# EAGLE design Output Mixer v1.1 (EAGLE 7.7.0)
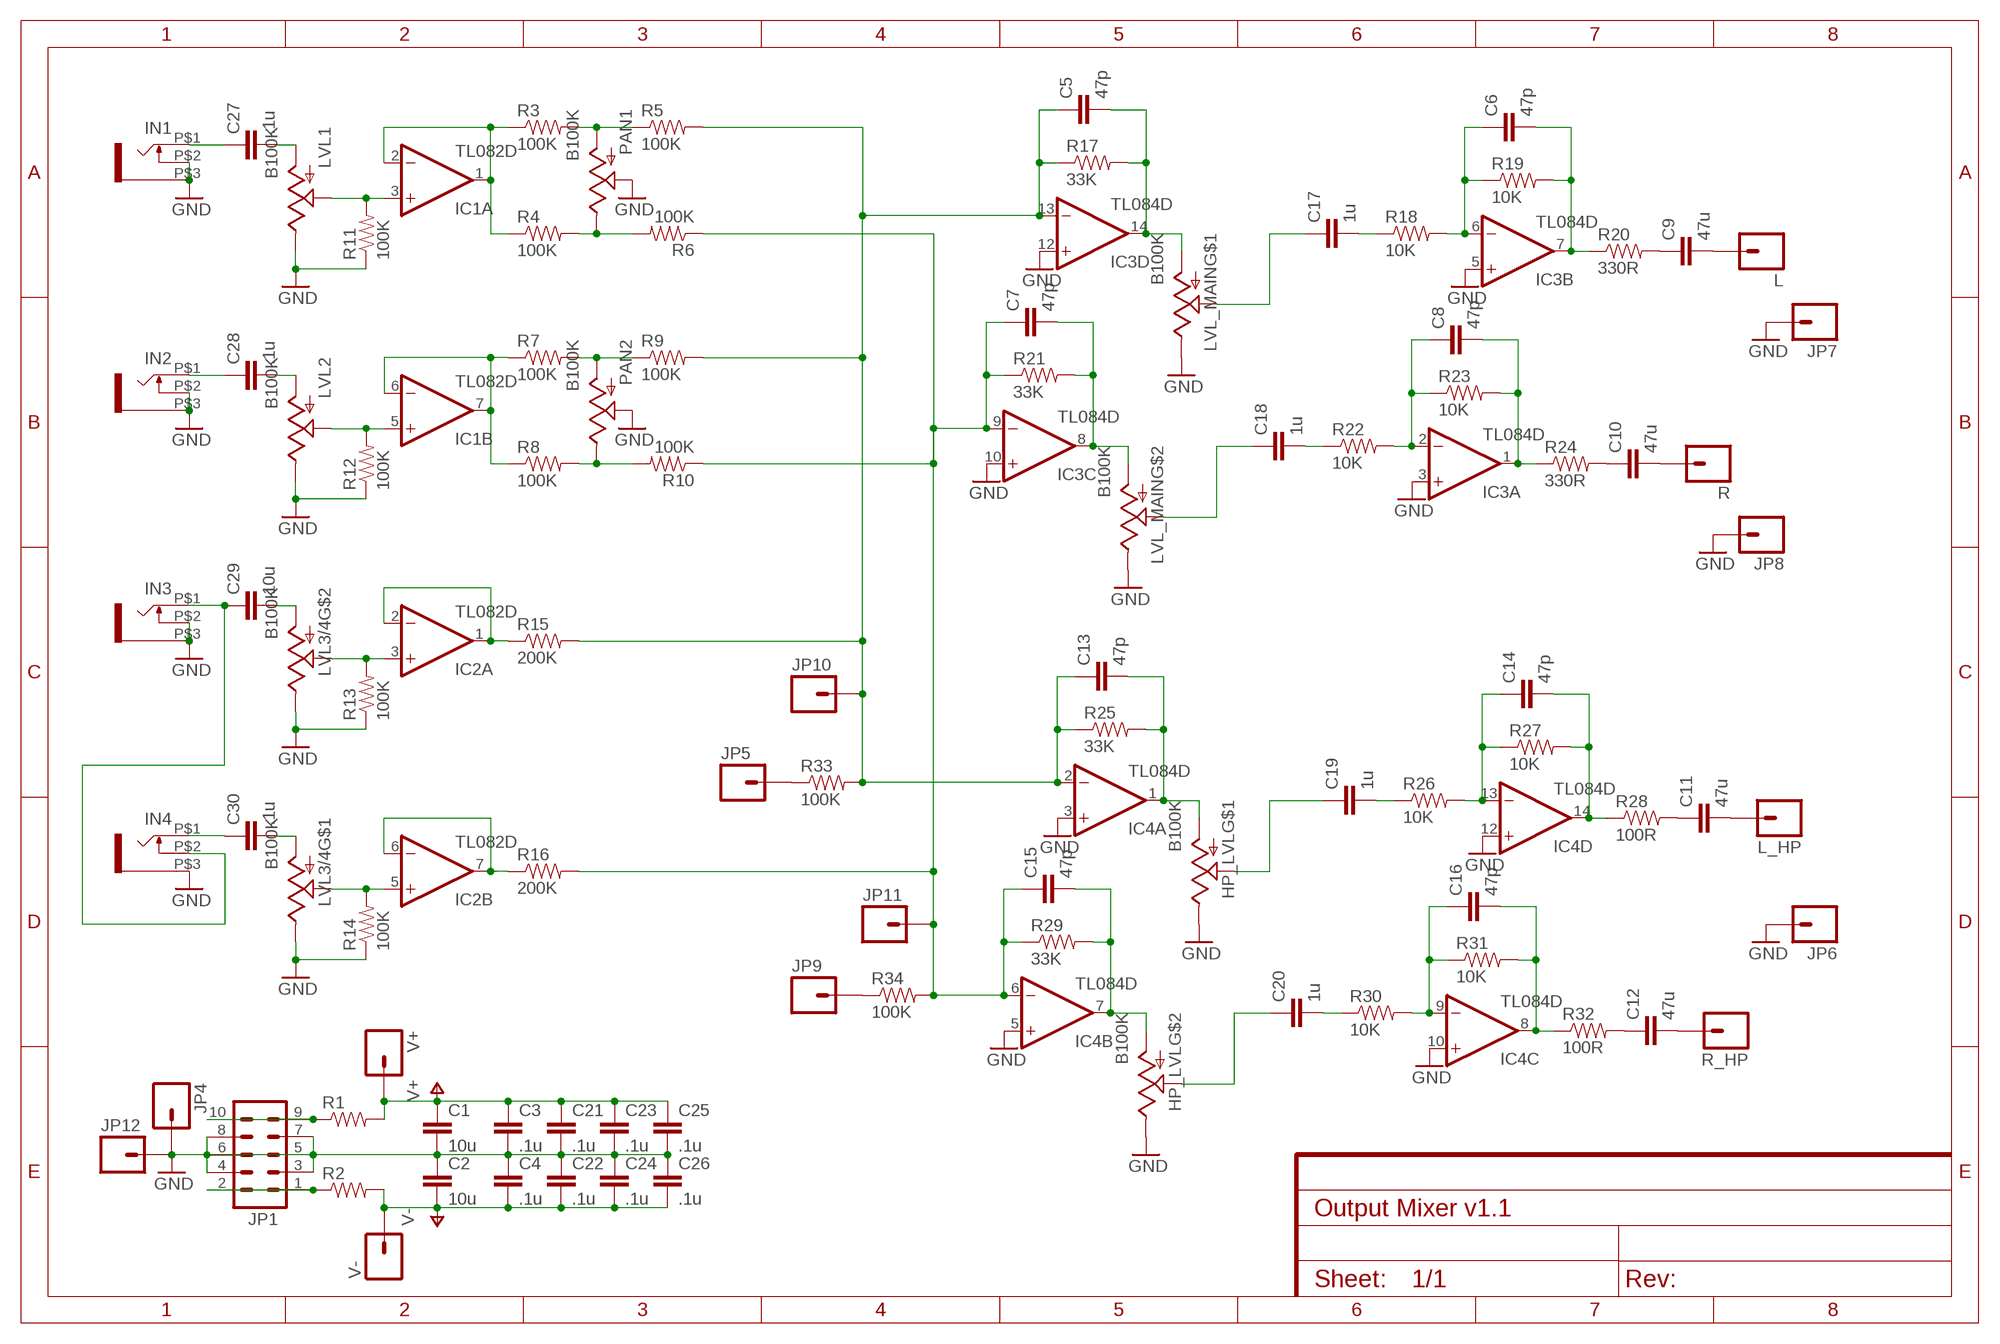
[diagram p0: schematic, sheet 1]

## Parts
C1  10u  CAP1206  [1206]
C2  10u  CAP1206  [1206]
C3  .1u  CAP0805  [0805]
C4  .1u  CAP0805  [0805]
C5  47p  CAP0805  [0805]
C6  47p  CAP0805  [0805]
C7  47p  CAP0805  [0805]
C8  47p  CAP0805  [0805]
C9  47u  CAP1206  [1206]
C10  47u  CAP1206  [1206]
C11  47u  CAP1206  [1206]
C12  47u  CAP1206  [1206]
C13  47p  CAP0805  [0805]
C14  47p  CAP0805  [0805]
C15  47p  CAP0805  [0805]
C16  47p  CAP0805  [0805]
C17  1u  CAP0805  [0805]
C18  1u  CAP0805  [0805]
C19  1u  CAP0805  [0805]
C20  1u  CAP0805  [0805]
C21  .1u  CAP0805  [0805]
C22  .1u  CAP0805  [0805]
C23  .1u  CAP0805  [0805]
C24  .1u  CAP0805  [0805]
C25  .1u  CAP0805  [0805]
C26  .1u  CAP0805  [0805]
C27  .1u  CAP1206  [1206]
C28  .1u  CAP1206  [1206]
C29  10u  CAP1206  [1206]
C30  .1u  CAP1206  [1206]
HP_LVL  B100K  POT_DUAL_ALPHA  [ALPS/ALPHA_POT_DUAL]
IC1  TL082D  [SO08]
IC2  TL082D  [SO08]
IC3  TL084D  [SO14]
IC4  TL084D  [SO14]
IN1  WQP-PJ301M-12_JACK  [WQP-PJ301M-12_JACK]
IN2  WQP-PJ301M-12_JACK  [WQP-PJ301M-12_JACK]
IN3  WQP-PJ301M-12_JACK  [WQP-PJ301M-12_JACK]
IN4  WQP-PJ301M-12_JACK  [WQP-PJ301M-12_JACK]
JP1  M05X2PTH  [AVR_ICSP]
JP4  M01PTH  [1X01]
JP5  M01PTH  [1X01]
JP6  M01PTH  [1X01]
JP7  M01PTH  [1X01]
JP8  M01PTH  [1X01]
JP9  M01PTH  [1X01]
JP10  M01PTH  [1X01]
JP11  M01PTH  [1X01]
JP12  M01PTH  [1X01]
L  M01PTH  [1X01]
L_HP  M01PTH  [1X01]
LVL1  B100K  POT  [ALPS_POT]
LVL2  B100K  POT  [ALPS_POT]
LVL3/4  B100K  POT_DUAL_ALPHA  [ALPS/ALPHA_POT_DUAL]
LVL_MAIN  B100K  POT_DUAL_ALPHA  [ALPS/ALPHA_POT_DUAL]
PAN1  B100K  POT  [ALPS_POT]
PAN2  B100K  POT  [ALPS_POT]
R  M01PTH  [1X01]
R1  RESISTOR0805-RES  [0805]
R2  RESISTOR0805-RES  [0805]
R3  100K  RESISTOR0805-RES  [0805]
R4  100K  RESISTOR0805-RES  [0805]
R5  100K  RESISTOR0805-RES  [0805]
R6  100K  RESISTOR0805-RES  [0805]
R7  100K  RESISTOR0805-RES  [0805]
R8  100K  RESISTOR0805-RES  [0805]
R9  100K  RESISTOR0805-RES  [0805]
R10  100K  RESISTOR0805-RES  [0805]
R11  100K  RESISTOR0805-RES  [0805]
R12  100K  RESISTOR0805-RES  [0805]
R13  100K  RESISTOR0805-RES  [0805]
R14  100K  RESISTOR0805-RES  [0805]
R15  200K  RESISTOR0805-RES  [0805]
R16  200K  RESISTOR0805-RES  [0805]
R17  33K  RESISTOR0805-RES  [0805]
R18  10K  RESISTOR0805-RES  [0805]
R19  10K  RESISTOR0805-RES  [0805]
R20  330R  RESISTOR0805-RES  [0805]
R21  33K  RESISTOR0805-RES  [0805]
R22  10K  RESISTOR0805-RES  [0805]
R23  10K  RESISTOR0805-RES  [0805]
R24  330R  RESISTOR0805-RES  [0805]
R25  33K  RESISTOR0805-RES  [0805]
R26  10K  RESISTOR0805-RES  [0805]
R27  10K  RESISTOR0805-RES  [0805]
R28  100R  RESISTOR0805-RES  [0805]
R29  33K  RESISTOR0805-RES  [0805]
R30  10K  RESISTOR0805-RES  [0805]
R31  10K  RESISTOR0805-RES  [0805]
R32  100R  RESISTOR0805-RES  [0805]
R33  100K  RESISTOR0805-RES  [0805]
R34  100K  RESISTOR0805-RES  [0805]
R_HP  M01PTH  [1X01]
V+  M01PTH  [1X01]
V-  M01PTH  [1X01]

## Nets
GND: C1.2 C2.1 C3.2 C4.1 C21.2 C22.1 C23.2 C24.1 C25.2 C26.1 HP_LVL.P$1(E) HP_LVL.P$4(E) IC3.3(A:+IN) IC3.5(B:+IN) IC3.10(C:+IN) IC3.12(D:+IN) IC4.3(A:+IN) IC4.5(B:+IN) IC4.10(C:+IN) IC4.12(D:+IN) IN1.P$2 IN1.P$3 IN2.P$2 IN2.P$3 IN3.P$2 IN3.P$3 IN4.P$3 JP1.3 JP1.4 JP1.5 JP1.6 JP1.7 JP1.8 JP4.1 JP6.1 JP7.1 JP8.1 JP12.1 LVL1.P$1(E) LVL2.P$1(E) LVL3/4.P$1(E) LVL3/4.P$4(E) LVL_MAIN.P$1(E) LVL_MAIN.P$4(E) PAN1.P$2(S) PAN2.P$2(S) R11.1 R12.1 R13.1 R14.1
N$1: JP1.9 JP1.10 R1.1
N$2: JP1.1 JP1.2 R2.1
N$3: JP5.1 R33.1
N$4: JP9.1 R34.1
N$5: C30.1 IN4.P$1
N$6: C30.2 LVL3/4.P$3(A)
N$7: IC1.3(A:+IN) LVL1.P$2(S) R11.2
N$8: IC1.5(B:+IN) LVL2.P$2(S) R12.2
N$9: IC2.6(B:-IN) IC2.7(B:OUT) R16.1
N$10: IC1.1(A:OUT) IC1.2(A:-IN) R3.1 R4.1
N$11: IC1.6(B:-IN) IC1.7(B:OUT) R7.1 R8.1
N$12: PAN1.P$3(A) R3.2 R5.1
N$13: PAN1.P$1(E) R4.2 R6.2
N$14: PAN2.P$3(A) R7.2 R9.1
N$15: PAN2.P$1(E) R8.2 R10.2
N$16: C29.1 IN3.P$1 IN4.P$2
N$17: IC2.3(A:+IN) LVL3/4.P$5(S) R13.2
N$18: C9.1 R20.2
N$19: IC2.5(B:+IN) LVL3/4.P$2(S) R14.2
N$20: IC2.1(A:OUT) IC2.2(A:-IN) R15.1
N$21: C10.1 R24.2
N$22: C7.2 IC3.8(C:OUT) LVL_MAIN.P$6(A) R21.2
N$23: C8.1 IC3.2(A:-IN) R22.2 R23.1
N$24: C8.2 IC3.1(A:OUT) R23.2 R24.1
N$25: C11.1 R28.2
N$26: C5.2 IC3.14(D:OUT) LVL_MAIN.P$3(A) R17.2
N$27: C6.1 IC3.6(B:-IN) R18.2 R19.1
N$28: C6.2 IC3.7(B:OUT) R19.2 R20.1
N$29: C12.1 R32.2
N$30: C12.2 R_HP.1
N$31: C11.2 L_HP.1
N$32: C9.2 L.1
N$33: C19.1 HP_LVL.P$2(S)
N$34: C19.2 R26.1
N$35: C7.1 C15.1 IC3.9(C:-IN) IC4.6(B:-IN) JP11.1 R6.1 R10.1 R16.2 R21.1 R29.1 R34.2
N$36: C15.2 HP_LVL.P$6(A) IC4.7(B:OUT) R29.2
N$37: C16.1 IC4.9(C:-IN) R30.2 R31.1
N$38: C16.2 IC4.8(C:OUT) R31.2 R32.1
N$39: C5.1 C13.1 IC3.13(D:-IN) IC4.2(A:-IN) JP10.1 R5.2 R9.2 R15.2 R17.1 R25.1 R33.2
N$40: C13.2 HP_LVL.P$3(A) IC4.1(A:OUT) R25.2
N$41: C14.1 IC4.13(D:-IN) R26.2 R27.1
N$42: C14.2 IC4.14(D:OUT) R27.2 R28.1
N$43: C10.2 R.1
N$44: C20.1 HP_LVL.P$5(S)
N$45: C20.2 R30.1
N$46: C29.2 LVL3/4.P$6(A)
N$47: C18.1 LVL_MAIN.P$5(S)
N$48: C28.1 IN2.P$1
N$49: C28.2 LVL2.P$3(A)
N$50: C27.1 IN1.P$1
N$51: C27.2 LVL1.P$3(A)
N$52: C18.2 R22.1
N$53: C17.1 LVL_MAIN.P$2(S)
N$54: C17.2 R18.1
V+: C1.1 C3.1 C21.1 C23.1 C25.1 R1.2 V+.1
V-: C2.2 C4.2 C22.2 C24.2 C26.2 R2.2 V-.1

## Power pins joined to a net without a drawn wire
V+: IC1.8(P:V+) IC2.8(P:V+) IC3.4(P:V+) IC4.4(P:V+)
V-: IC1.4(P:V-) IC2.4(P:V-) IC3.11(P:V-) IC4.11(P:V-)

## Library data of the parts
C1-C30 = SparkFun-Capacitors:CAP: Capacitor Standard 0603 ceramic capacitor, and 0.1" leaded capacitor.
HP_LVL LVL3/4 LVL_MAIN = SparkFun-Electromechanical:POT_DUAL_ALPHA
IC1 IC2 = linear:TL082: OP AMP Data sheet <http://www.ti.com/lit/ds/symlink/tl084a . pdf>; DATA_SHEET: <a href="http://www.ti.com/lit/ds/symlink/tl084a.pdf"> Data sheet </a>
IC3 IC4 = linear:TL084: OP AMP
IN1-IN4 = thonkiconn:WQP-PJ301M-12_JACK
JP1 = SparkFun-Connectors:M05X2: Header 5x2 Standard 10-pin dual row 0.1" header. Commonly used with AVR-ISP. Use with Spark Fun Electronics SKU: PRT-00778
JP4-JP12 L L_HP R R_HP V+ V- = SparkFun-Connectors:M01: Header 1 Standard 1-pin 0.1" header. Use with straight break away headers (SKU : PRT-00116), right angle break away headers (PRT-00553), swiss pins (PRT-00743), machine pins (PRT-00117), and female headers (PRT-00115).
LVL1 LVL2 PAN1 PAN2 = SparkFun-Electromechanical:POT; PROD_ID: RES-09177
R1-R34 = SparkFun-Passives:RESISTOR: Resistor Basic schematic elements and footprints for 0603, 1206, and PTH resistors.

## Board
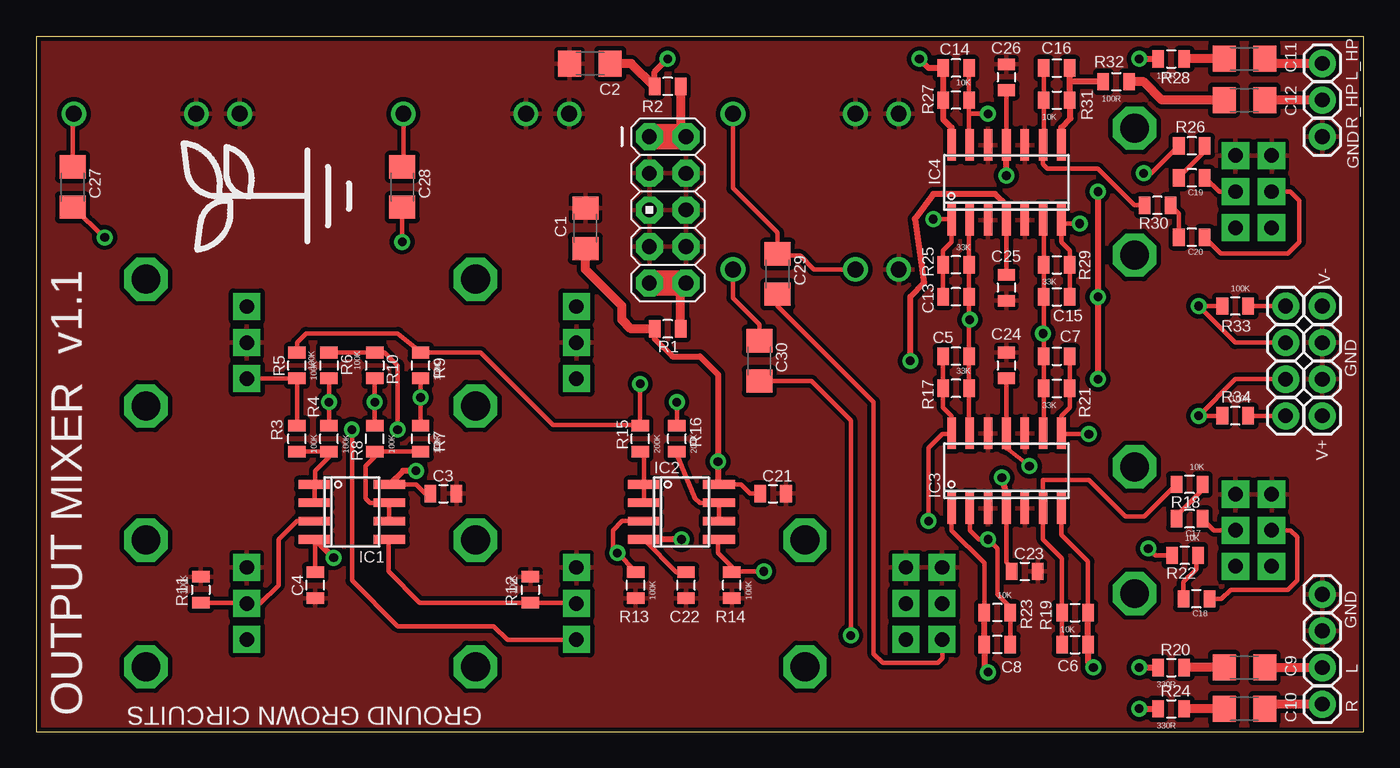
[diagram p1: board, top side]
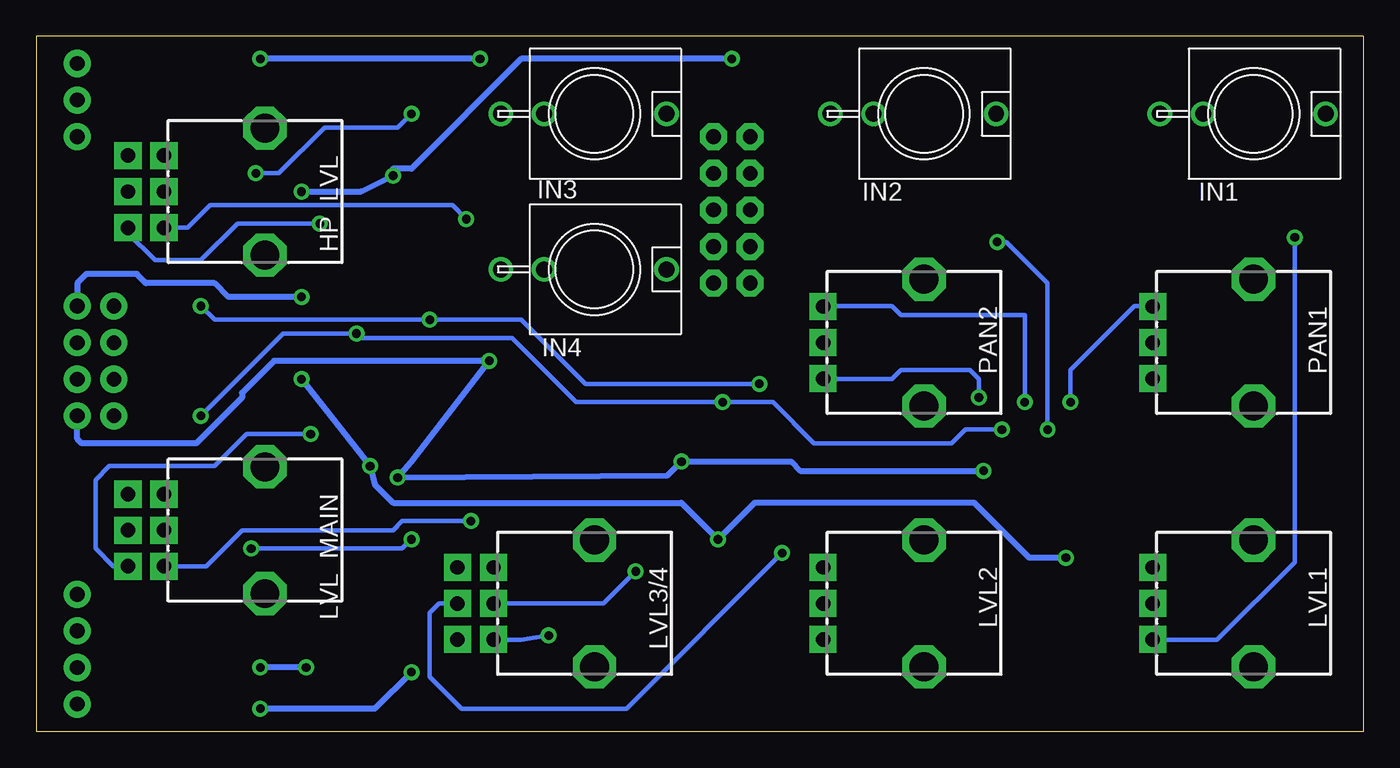
[diagram p2: board, bottom side, seen from below]

Size 92.08 x 48.26 mm. Coordinates in mm from the lower left corner, seen from the top.
Outline: 0,0 92.08,0 92.08,48.26 0,48.26 0,0
Copper layers (1*16): Top 0.035mm / dielectric 1.5mm / Bottom 0.035mm
Design rules "SparkFun": minimum track width 8mil, minimum drill 20mil, track to track 8mil, track to pad 8mil, pad to pad 8mil, via to via 8mil, smd to smd 8mil, copper to edge 8mil, drill to drill 8mil, minimum pad ring 12mil, minimum via ring 10mil, stop-mask expansion 4mil, vias tented up to drill 20mil, thermal gap 10mil

### Footprints (pad centres in the part's own frame; a part is rotated, then mirrored left to right if it is on the bottom)
1206 = smd 1.6 x 1.8: 1 -1.4,0; 2 1.4,0
0805 = smd 0.8 x 1.2: 1 -0.9,0; 2 0.9,0
ALPS/ALPHA_POT_DUAL = drill 1 pad 1.88 square: P$1 7,-2.5; P$2 7,0; P$3 7,2.5; P$4 9.5,-2.5; P$5 9.5,0; P$6 9.5,2.5 | drill 2 octagon: P$A 0,-4.4; P$B 0,4.4
SO08 = smd 0.6 x 2.2: 1 -1.905,-2.6; 2 -0.635,-2.6; 3 0.635,-2.6; 4 1.905,-2.6; 5 1.905,2.6; 6 0.635,2.6; 7 -0.635,2.6; 8 -1.905,2.6
SO14 = smd 0.6 x 2.2: 1 -3.81,-2.6; 2 -2.54,-2.6; 3 -1.27,-2.6; 4 0,-2.6; 5 1.27,-2.6; 6 2.54,-2.6; 7 3.81,-2.6; 8 3.81,2.6; 9 2.54,2.6; 10 1.27,2.6; 11 0,2.6; 12 -1.27,2.6; 13 -2.54,2.6; 14 -3.81,2.6
WQP-PJ301M-12_JACK = drill 1.1: P$1 0,5; P$2 0,-3.5; P$3 0,-6.5
AVR_ICSP = drill 1.016 pad 1.88 octagon: 1 -1.27,5.08; 2 1.27,5.08; 3 -1.27,2.54; 4 1.27,2.54; 5 -1.27,0; 6 1.27,0; 7 -1.27,-2.54; 8 1.27,-2.54; 9 -1.27,-5.08; 10 1.27,-5.08
1X01 = drill 1.016 pad 1.88: 1 0,0
ALPS_POT = drill 1 pad 1.88 square: P$1 7,-2.5; P$2 7,0; P$3 7,2.5 | drill 2 octagon: P$4 0,-4.4; P$5 0,4.4

### Placement (x,y rotation side)
C1  38.1,34.92 90 top
C2  38.42,46.35 0 top
C3  28.26,16.51 0 top
C4  19.37,10.16 90 top
C5  63.82,26.04 180 top
C6  72.07,6.03 0 top
C7  70.8,26.04 0 top
C8  66.67,6.03 180 top
C9  83.82,4.45 0 top
C10  83.82,1.59 0 top
C11  83.82,46.67 0 top
C12  83.82,43.81 0 top
C13  63.82,30.16 180 top
C14  63.82,46.04 180 top
C15  70.8,30.16 0 top
C16  70.8,46.04 0 top
C17  80.01,14.76 180 top
C18  80.49,9.21 180 top
C19  80.17,38.42 180 top
C20  80.17,34.29 180 top
C21  51.12,16.51 0 top
C22  45.09,10.16 90 top
C23  68.58,11.11 0 top
C24  67.31,25.4 270 top
C25  67.31,30.8 270 top
C26  67.31,45.4 270 top
C27  2.54,37.78 270 top
C28  25.4,37.78 270 top
C29  51.44,31.75 270 top
C30  50.16,25.72 270 top
HP_LVL  76.2,37.47 180 bottom
IC1  21.91,15.24 270 top
IC2  44.77,15.24 270 top
IC3  67.31,18.1 0 top
IC4  67.31,38.1 0 top
IN1  7.62,42.86 270 bottom
IN2  30.48,42.86 270 bottom
IN3  53.34,42.86 270 bottom
IN4  53.34,32.07 270 bottom
JP1  43.81,36.2 0 top
JP4  89.22,26.99 0 top
JP5  86.68,29.53 0 top
JP6  89.22,41.27 0 top
JP7  89.22,9.53 0 top
JP8  89.22,6.99 0 top
JP9  86.68,21.91 0 top
JP10  86.68,26.99 0 top
JP11  86.68,24.45 0 top
JP12  89.22,24.45 0 top
L  89.22,4.45 0 top
L_HP  89.22,46.35 0 top
LVL1  7.62,8.89 180 bottom
LVL2  30.48,8.89 180 bottom
LVL3/4  53.34,8.89 180 bottom
LVL_MAIN  76.2,13.97 180 bottom
PAN1  7.62,26.99 180 bottom
PAN2  30.48,26.99 180 bottom
R  89.22,1.91 0 top
R1  43.81,27.94 180 top
R2  43.81,44.77 180 top
R3  18.1,20.32 90 top
R4  20.32,20.32 90 top
R5  18.1,25.4 90 top
R6  20.32,25.4 270 top
R7  26.67,20.32 90 top
R8  23.5,20.32 90 top
R9  26.67,25.4 90 top
R10  23.5,25.4 270 top
R11  11.43,9.84 270 top
R12  34.29,9.84 270 top
R13  41.59,10.16 90 top
R14  48.26,10.16 90 top
R15  41.91,20.32 90 top
R16  44.45,20.32 90 top
R17  63.82,23.81 180 top
R18  80.01,17.14 180 top
R19  72.07,8.26 0 top
R20  78.74,4.45 0 top
R21  70.8,23.81 0 top
R22  79.69,12.22 180 top
R23  66.67,8.26 180 top
R24  78.74,1.59 0 top
R25  63.82,32.38 180 top
R26  80.17,40.64 180 top
R27  63.82,43.81 180 top
R28  78.74,46.67 0 top
R29  70.8,32.38 0 top
R30  77.79,36.51 180 top
R31  70.8,43.81 0 top
R32  74.93,45.09 0 top
R33  83.19,29.53 180 top
R34  83.19,21.91 180 top
R_HP  89.22,43.81 0 top
U$1  [LOGO_MED]  18.73,37.15 90 top
V+  89.22,21.91 0 top
V-  89.22,29.53 0 top

### Tracks (layer width: path | path; a pad name or v marks a point on that pad's centre or on a via)
GND
  pour Top (isolate 0.305): 0,0 0,48.26 92.08,48.26 92.08,0
N$1
  Top 0.61: R1.1 44.72,30.75 JP1.10
  Top 1.778: JP1.9 JP1.10
N$2
  Top 0.61: R2.1 44.72,41.65 JP1.2
  Top 1.778: JP1.1 JP1.2
N$3
  Top 0.305: R33.1 JP5.1
N$4
  Top 0.305: R34.1 JP9.1
N$5
  Top 0.305: IN4.P$1 48.34,30.08 50.16,28.26 C30.1
N$6  (via drill 0.6)
  Top 0.305: C30.2 53.79,24.32 56.52,21.59 v56.52,6.67
  Bottom 0.305: v56.52,6.67 58.42,6.35 60.3,6.35 LVL3/4.P$3
N$7
  Top 0.305: R11.2 14.57,8.94 LVL1.P$2 15.56,8.89 16.83,10.16 16.83,13.34 18.1,14.61 IC1.3
N$8
  Top 0.305: LVL2.P$2 37.43,8.94 R12.2 26.62,8.94 24.45,11.11 24.45,13.28 IC1.5
N$9
  Top 0.305: IC2.6 IC2.7 46.04,15.88 45.72,16.19 44.77,18.41 44.4,19.37 R16.1
N$10
  Top 0.305: IC1.2 IC1.1 19.37,17.2 19.37,18.1 20.32,19.05 R4.1 R3.1
N$11
  Top 0.305: IC1.6 IC1.7 23.18,15.88 22.86,16.19 22.86,18.41 23.5,19.05 R8.1 R7.1
N$12
  Top 0.305: R3.2 R5.1 14.63,24.5 PAN1.P$3
N$13  (via drill 0.6)
  Top 0.305: R4.2 v20.32,22.86 R6.2
  Bottom 0.305: v20.32,22.86 20.32,25.08 15.88,29.53 14.66,29.53 PAN1.P$1
N$14  (via drill 0.6)
  Top 0.305: R7.2 v26.67,23.18 R9.1
  Bottom 0.305: v26.67,23.18 26.67,24.45 27.3,25.08 32.07,25.08 32.7,24.45 37.44,24.45 PAN2.P$3
N$15  (via drill 0.6)
  Top 0.305: R8.2 v23.5,22.86 R10.2
  Bottom 0.305: v23.5,22.86 23.5,28.89 32.07,28.89 32.7,29.53 37.44,29.53 PAN2.P$1
N$16
  Top 0.305: IN3.P$1 48.34,37.7 51.44,34.61 C29.1 51.56,33.02 53.02,33.02 53.98,32.07 IN4.P$2
N$17  (via drill 0.6)
  Top 0.305: R13.2 41.59,11.11 v40.32,12.38 40.01,12.7 40.01,13.97 40.64,14.61 IC2.3
  Bottom 0.305: LVL3/4.P$5 64.14,8.89 64.77,8.26 64.77,3.81 62.55,1.59 51.12,1.59 v40.32,12.38
N$18
  Top 0.61: C9.1 R20.2
N$19  (via drill 0.6)
  Top 0.305: IC2.5 47.31,13.28 47.31,12.38 48.26,11.43 R14.2 48.31,11.11 v50.48,11.11
  Bottom 0.305: LVL3/4.P$2 52.7,8.89 v50.48,11.11
N$20
  Top 0.305: IC2.2 IC2.1 42.17,19.16 R15.1
N$21
  Top 0.61: C10.1 R24.2
N$22  (via drill 0.6)
  Top 0.305: C7.2 R21.2 71.7,22.49 71.12,21.91 IC3.8 71.18,20.64 v73.03,20.64
  Bottom 0.305: LVL_MAIN.P$6 86.72,11.47 87.95,12.7 87.95,17.46 87,18.41 79.69,18.41 77.47,20.64 v73.03,20.64
N$23  (via drill 0.6)
  Top 0.305: C8.1 R23.1 67.58,8.62 66.67,9.53 66.67,12.7 v66.04,13.34 65.41,13.34 64.77,13.97 IC3.2 | R22.2 77.63,12.22 v77.15,12.7
  Bottom 0.305: v77.15,12.7 66.67,12.7 v66.04,13.34
N$24  (via drill 0.6)
  Top 0.305: R23.2 65.78,11.7 63.5,13.97 IC3.1
  Top 0.406: R23.2 C8.2 65.78,4.39 v66.04,4.13 | v76.52,1.59 R24.1
  Bottom 0.406: v66.04,4.13 68.58,1.59 v76.52,1.59
N$25
  Top 0.61: C11.1 R28.2
N$26  (via drill 0.6)
  Top 0.305: C5.2 R17.2 62.92,22.49 63.5,21.91 IC3.14 63.44,20.64 62.87,20.64 61.91,19.68 v61.91,14.61
  Bottom 0.305: LVL_MAIN.P$3 80.29,11.47 77.79,13.97 67.31,13.97 66.67,14.61 v61.91,14.61
N$27
  Top 0.305: C6.1 R19.1 71.17,12.01 69.85,13.34 IC3.6 69.85,17.46 73.03,17.46 75.56,14.92 76.89,14.92 R18.2
N$28  (via drill 0.6)
  Top 0.305: R19.2 72.97,11.8 71.12,13.65 IC3.7
  Top 0.406: R19.2 C6.2 72.97,4.82 v73.34,4.45 | v76.52,4.45 R20.1
  Bottom 0.406: v73.34,4.45 v76.52,4.45
N$29
  Top 0.61: C12.1 78.11,43.81 76.83,45.09 R32.2
N$30
  Top 0.61: R_HP.1 C12.2
N$31
  Top 0.61: L_HP.1 85.54,46.35 C11.2
N$32
  Top 0.61: C9.2 L.1
N$33
  Top 0.305: C19.1 81.12,38.42 82.07,37.47 HP_LVL.P$2
N$34
  Top 0.305: C19.2 79.27,38.47 80.96,40.16 80.96,40.53 R26.1
N$35  (via drill 0.6)
  Top 0.305: IC3.9 69.9,20.75 R21.1 C7.1 69.9,27.57 v69.85,27.62 69.9,27.68 C15.1 R29.1 69.9,35.45 IC4.6 | R34.2 v80.64,21.91 83.19,24.45 JP11.1 | R6.1 R10.1 24.18,26.3 25.08,25.4 v25.08,20.95 | R16.2 v44.45,22.86
  Bottom 0.305: v80.64,21.91 74.93,27.62 v69.85,27.62 69.53,27.3 59.05,27.3 54.61,22.86 v44.45,22.86 40.96,22.86 38.1,20 28.57,20 27.62,20.95 v25.08,20.95
N$36  (via drill 0.6)
  Top 0.305: C15.2 R29.2 71.7,33.39 71.12,33.97 IC4.7 71.38,35.24 v72.39,35.24
  Bottom 0.305: HP_LVL.P$6 85.7,34.58 83.82,32.7 80.64,32.7 78.11,35.24 v72.39,35.24
N$37
  Top 0.305: C16.1 R31.1 69.9,40.75 IC4.9 69.85,39.37 70.17,39.05 73.66,39.05 76.2,36.51 R30.2
N$38
  Top 0.406: 71.7,45.09 R31.2 71.75,43.76 71.75,42.55 71.12,41.91 IC4.8 | 71.7,45.09 C16.2 | R32.1 71.7,45.09
N$39  (via drill 0.6)
  Top 0.305: IC3.13 64.72,20.75 R17.1 C5.1 64.72,28.52 v64.77,28.57 64.72,28.63 C13.1 R25.1 64.72,35.45 IC4.2 | R33.2 v80.64,29.53 83.19,26.99 JP10.1 | R5.2 18.1,26.99 18.73,27.62 25.08,27.62 26.67,26.35 R9.2 30.85,26.3 35.88,21.27 41.86,21.27 R15.2 v41.91,24.13
  Bottom 0.305: v80.64,29.53 79.69,28.57 v64.77,28.57 58.42,28.57 53.98,24.13 v41.91,24.13
N$40  (via drill 0.6)
  Top 0.305: C13.2 R25.2 62.92,33.39 63.5,33.97 IC4.1 63.44,35.56 v62.23,35.56
  Bottom 0.305: HP_LVL.P$3 81.56,34.97 80.01,36.51 63.18,36.51 v62.23,35.56
N$41  (via drill 0.6)
  Top 0.305: C14.1 R27.1 64.72,42.86 | 64.72,42.86 64.72,40.75 IC4.13 | v66.04,42.86 64.72,42.86 | v76.83,38.73 77.36,38.73 R26.2
  Bottom 0.305: v76.83,38.73 75.25,38.73 72.07,41.91 66.99,41.91 v66.04,42.86
N$42  (via drill 0.6)
  Top 0.406: IC4.14 63.5,41.91 62.92,42.49 R27.2 C14.2 61.91,46.04 v61.28,46.67 | v76.52,46.67 R28.1
  Bottom 0.406: v61.28,46.67 v76.52,46.67
N$43
  Top 0.61: R.1 85.54,1.91 C10.2
N$44
  Top 0.305: HP_LVL.P$5 87,37.47 87.63,36.83 87.63,33.97 86.84,33.18 82.18,33.18 C20.1
N$45
  Top 0.305: C20.2 79.27,35.93 R30.1
N$46
  Top 0.305: C29.2 51.44,29.53 58.1,22.86 58.1,5.4 58.74,4.76 62.55,4.76 62.87,5.08 62.87,6.37 LVL3/4.P$6
N$47
  Top 0.305: LVL_MAIN.P$5 87,13.97 87.47,13.49 87.47,10.48 86.84,9.84 82.87,9.84 82.23,9.21 C18.1
N$48
  Top 0.305: IN2.P$1 25.48,39.26 C28.1
N$49  (via drill 0.6)
  Top 0.305: C28.2 v25.4,33.97 | v21.91,20.95 21.91,10.48 25.08,7.3 31.75,7.3 32.7,6.35 37.44,6.35 LVL2.P$3
  Bottom 0.305: v25.4,33.97 24.77,33.97 21.91,31.11 v21.91,20.95
N$50
  Top 0.305: IN1.P$1 2.54,42.86 C27.1
N$51  (via drill 0.6)
  Top 0.305: C27.2 v4.76,34.29
  Bottom 0.305: v4.76,34.29 4.76,11.75 10.16,6.35 14.58,6.35 LVL1.P$3
N$52
  Top 0.305: C18.2 79.59,10.37 80.49,11.27 80.49,12.12 R22.1
N$53
  Top 0.305: LVL_MAIN.P$2 81.7,13.97 C17.1
N$54
  Top 0.305: C17.2 79.11,14.97 80.8,16.67 80.8,17.04 R18.1
V+  (via drill 0.6)
  Top 0.305: IC1.8 26.35,17.14 26.99,16.51 C3.1 | C23.1 67.68,11.38 67.31,11.75 IC3.4 | IC4.4 C25.1 | IC2.8 48.9,17.14 49.53,16.51 C21.1
  Top 0.406: R1.2 42.91,27.25 44.13,26.04 46.04,26.04 47.31,24.77 v47.31,18.73 47.31,17.2 IC2.8 | v26.35,18.1 25.46,18.1 IC1.8 | IC3.4 67.31,16.51 v66.99,17.62 | v60.64,25.72 60.64,30.16 61.59,31.11 60.96,35.56 62.23,37.31 66.52,37.31 67.31,36.51 IC4.4
  Top 0.61: R1.2 41.27,27.94 40.64,28.57 40.64,29.53 38.1,32.07 C1.1
  Bottom 0.406: v26.35,18.1 39.05,18.1 39.69,18.73 v47.31,18.73 48.26,17.78 v66.99,17.62 66.04,18.73 v60.64,25.72 75.56,25.72 77.79,23.5 77.79,23.18 80.96,20 88.9,20 89.22,20.32 V+.1
V-  (via drill 0.6)
  Top 0.305: C4.2 19.37,13.28 IC1.4 | C24.2 IC3.11 | IC4.11 C26.2 | C22.2 44.44,11.06 IC2.4 | v68.9,18.41 67.31,19.68
  Top 0.406: R2.2 42.91,45.77 v43.81,46.67 | v67.31,38.58 IC4.11 | v73.66,24.45 v73.66,30.16 v73.66,37.47 | 67.31,19.68 IC3.11 | v44.77,13.34 IC2.4 | 19.37,13.28 19.43,13.28 v20.64,12.06
  Top 0.61: R2.2 42.86,44.77 41.27,46.35 C2.2
  Bottom 0.406: v43.81,46.67 58.42,46.67 66.04,39.05 67.31,39.05 v67.31,38.58 69.53,37.47 v73.66,37.47 | v73.66,24.45 v68.9,18.41 68.58,17.14 67.31,15.88 47.31,15.88 v44.77,13.34 42.23,15.88 26.99,15.88 23.18,12.06 v20.64,12.06 | v73.66,30.16 78.74,30.16 79.69,31.11 84.45,31.11 85.09,31.75 88.58,31.75 89.22,31.11 V-.1

### Text on the board
tPlace: GND | v1.1 | GND | GND | GROUND GROWN CIRCUITS | OUTPUT MIXER